# Altium schematic sheet wireless.schdoc: WIRELESS
size A4; Date: 04.10.2026; CheckedBy: BCY; DrawnBy: miaow; Revision: v1.0.0; SheetNumber: 13; SheetTotal: 18; BoardType: MAIN_PCB; Desc: BT & WiFi
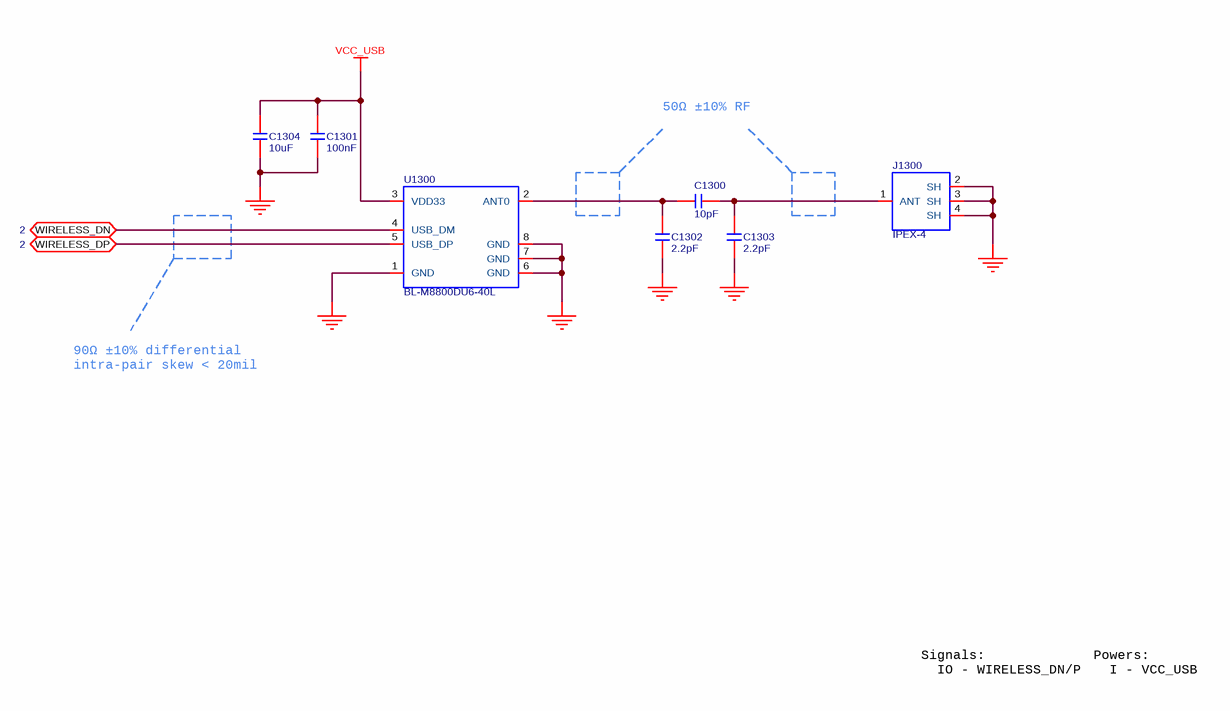
[diagram p0: wireless.schdoc]

## Parts
C1300  value 10pF  [C0201]  (hidden comment: C-NOMO)
C1301  value 100nF  [C0402]  (hidden comment: C-NOMO)
C1302  value 2.2pF  [C0201]  (hidden comment: C-NOMO)
C1303  value 2.2pF  [C0201]  (hidden comment: C-NOMO)
C1304  value 10uF  [C0402]  (hidden comment: C-NOMO)
J1300  IPEX-4  [IPEX-4]
U1300  BL-M8800DU6-40L  [BL-M8800DU6-40L]

## Ports
WIRELESS_DN (bidir, see 2), WIRELESS_DP (bidir, see 2)

## Nets
GND: C1301.2 C1302.2 C1303.2 C1304.1 J1300.2(SH) J1300.3(SH) J1300.4(SH) U1300.1(GND) U1300.6(GND) U1300.7(GND) U1300.8(GND)
VCC_USB: C1301.1 C1304.2 U1300.3(VDD33)
WIRELESS_DN: U1300.4(USB_DM) ; port WIRELESS_DN
WIRELESS_DP: U1300.5(USB_DP) ; port WIRELESS_DP
NetC1300_1: C1300.1 C1303.1 J1300.1(ANT)
NetC1300_2: C1300.2 C1302.1 U1300.2(ANT0)

## Notes on the sheet
- 50Ω ±10% RF
- 90Ω ±10% differential
- intra-pair skew < 20mil
- Signals:
  IO - WIRELESS_DN/P
- Powers:
  I - VCC_USB
- DRAWN
- CHECKED
- DRAWNBY
- SHEETS
- SHEETS_NO

## Library data of the parts
C1300 = C-NOMO: voltage: 25V; precision: 5%; Supplier 1: LCSC; Supplier Part Number 1: C43535
C1301 = C-NOMO: voltage: 50V; precision: 10%; Supplier 1: LCSC; Supplier Part Number 1: C307331
C1302 C1303 = C-NOMO: voltage: 25V; precision: 0.25pF; Supplier 1: LCSC; Supplier Part Number 1: C514586
C1304 = C-NOMO: voltage: 6.3V; precision: 20%; Supplier 1: LCSC; Supplier Part Number 1: C15525
J1300 = IPEX-4: SOCKET - RF; Suppiler 1: LCSC; Supplier Part Number 1: C47986642
U1300 = BL-M8800DU6-40L: BTWIFI; Supplier 1: taobao; Supplier Part Number 1: BL-M8800DU6-40L